# EAGLE schematic ArrayC_v2zp (EAGLE 7.5.0)
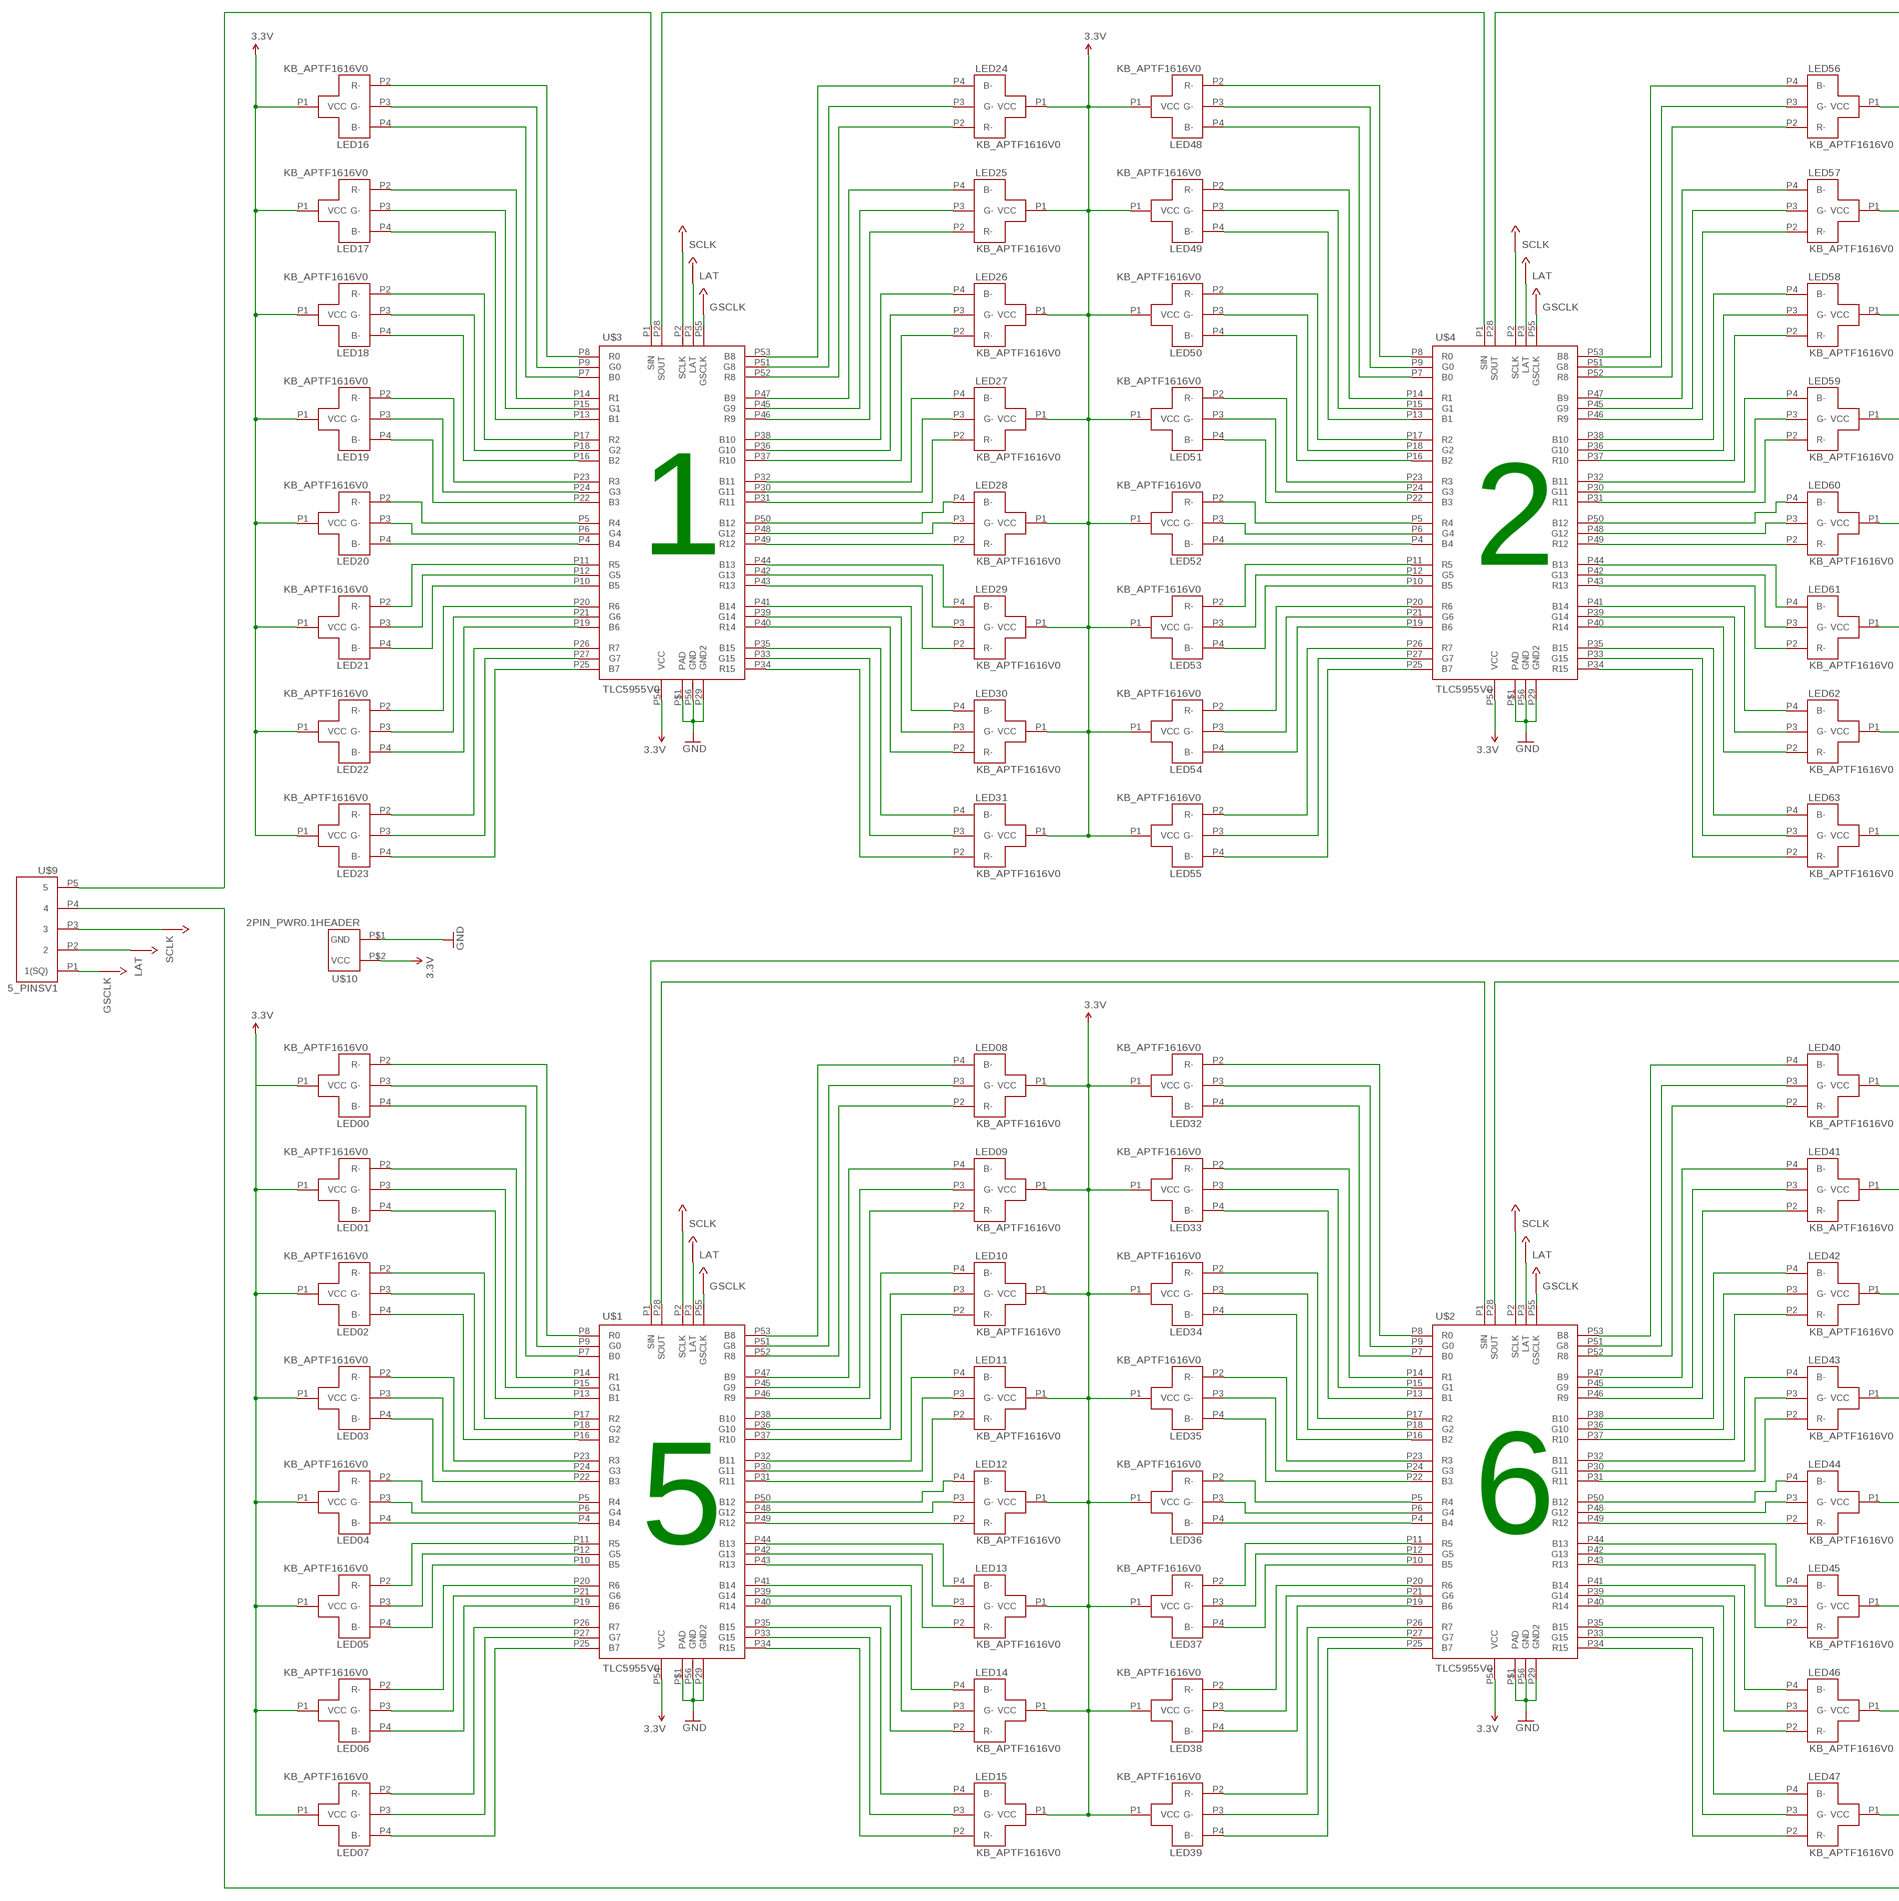
[diagram p0: schematic, sheet 1, part 1 of 2]
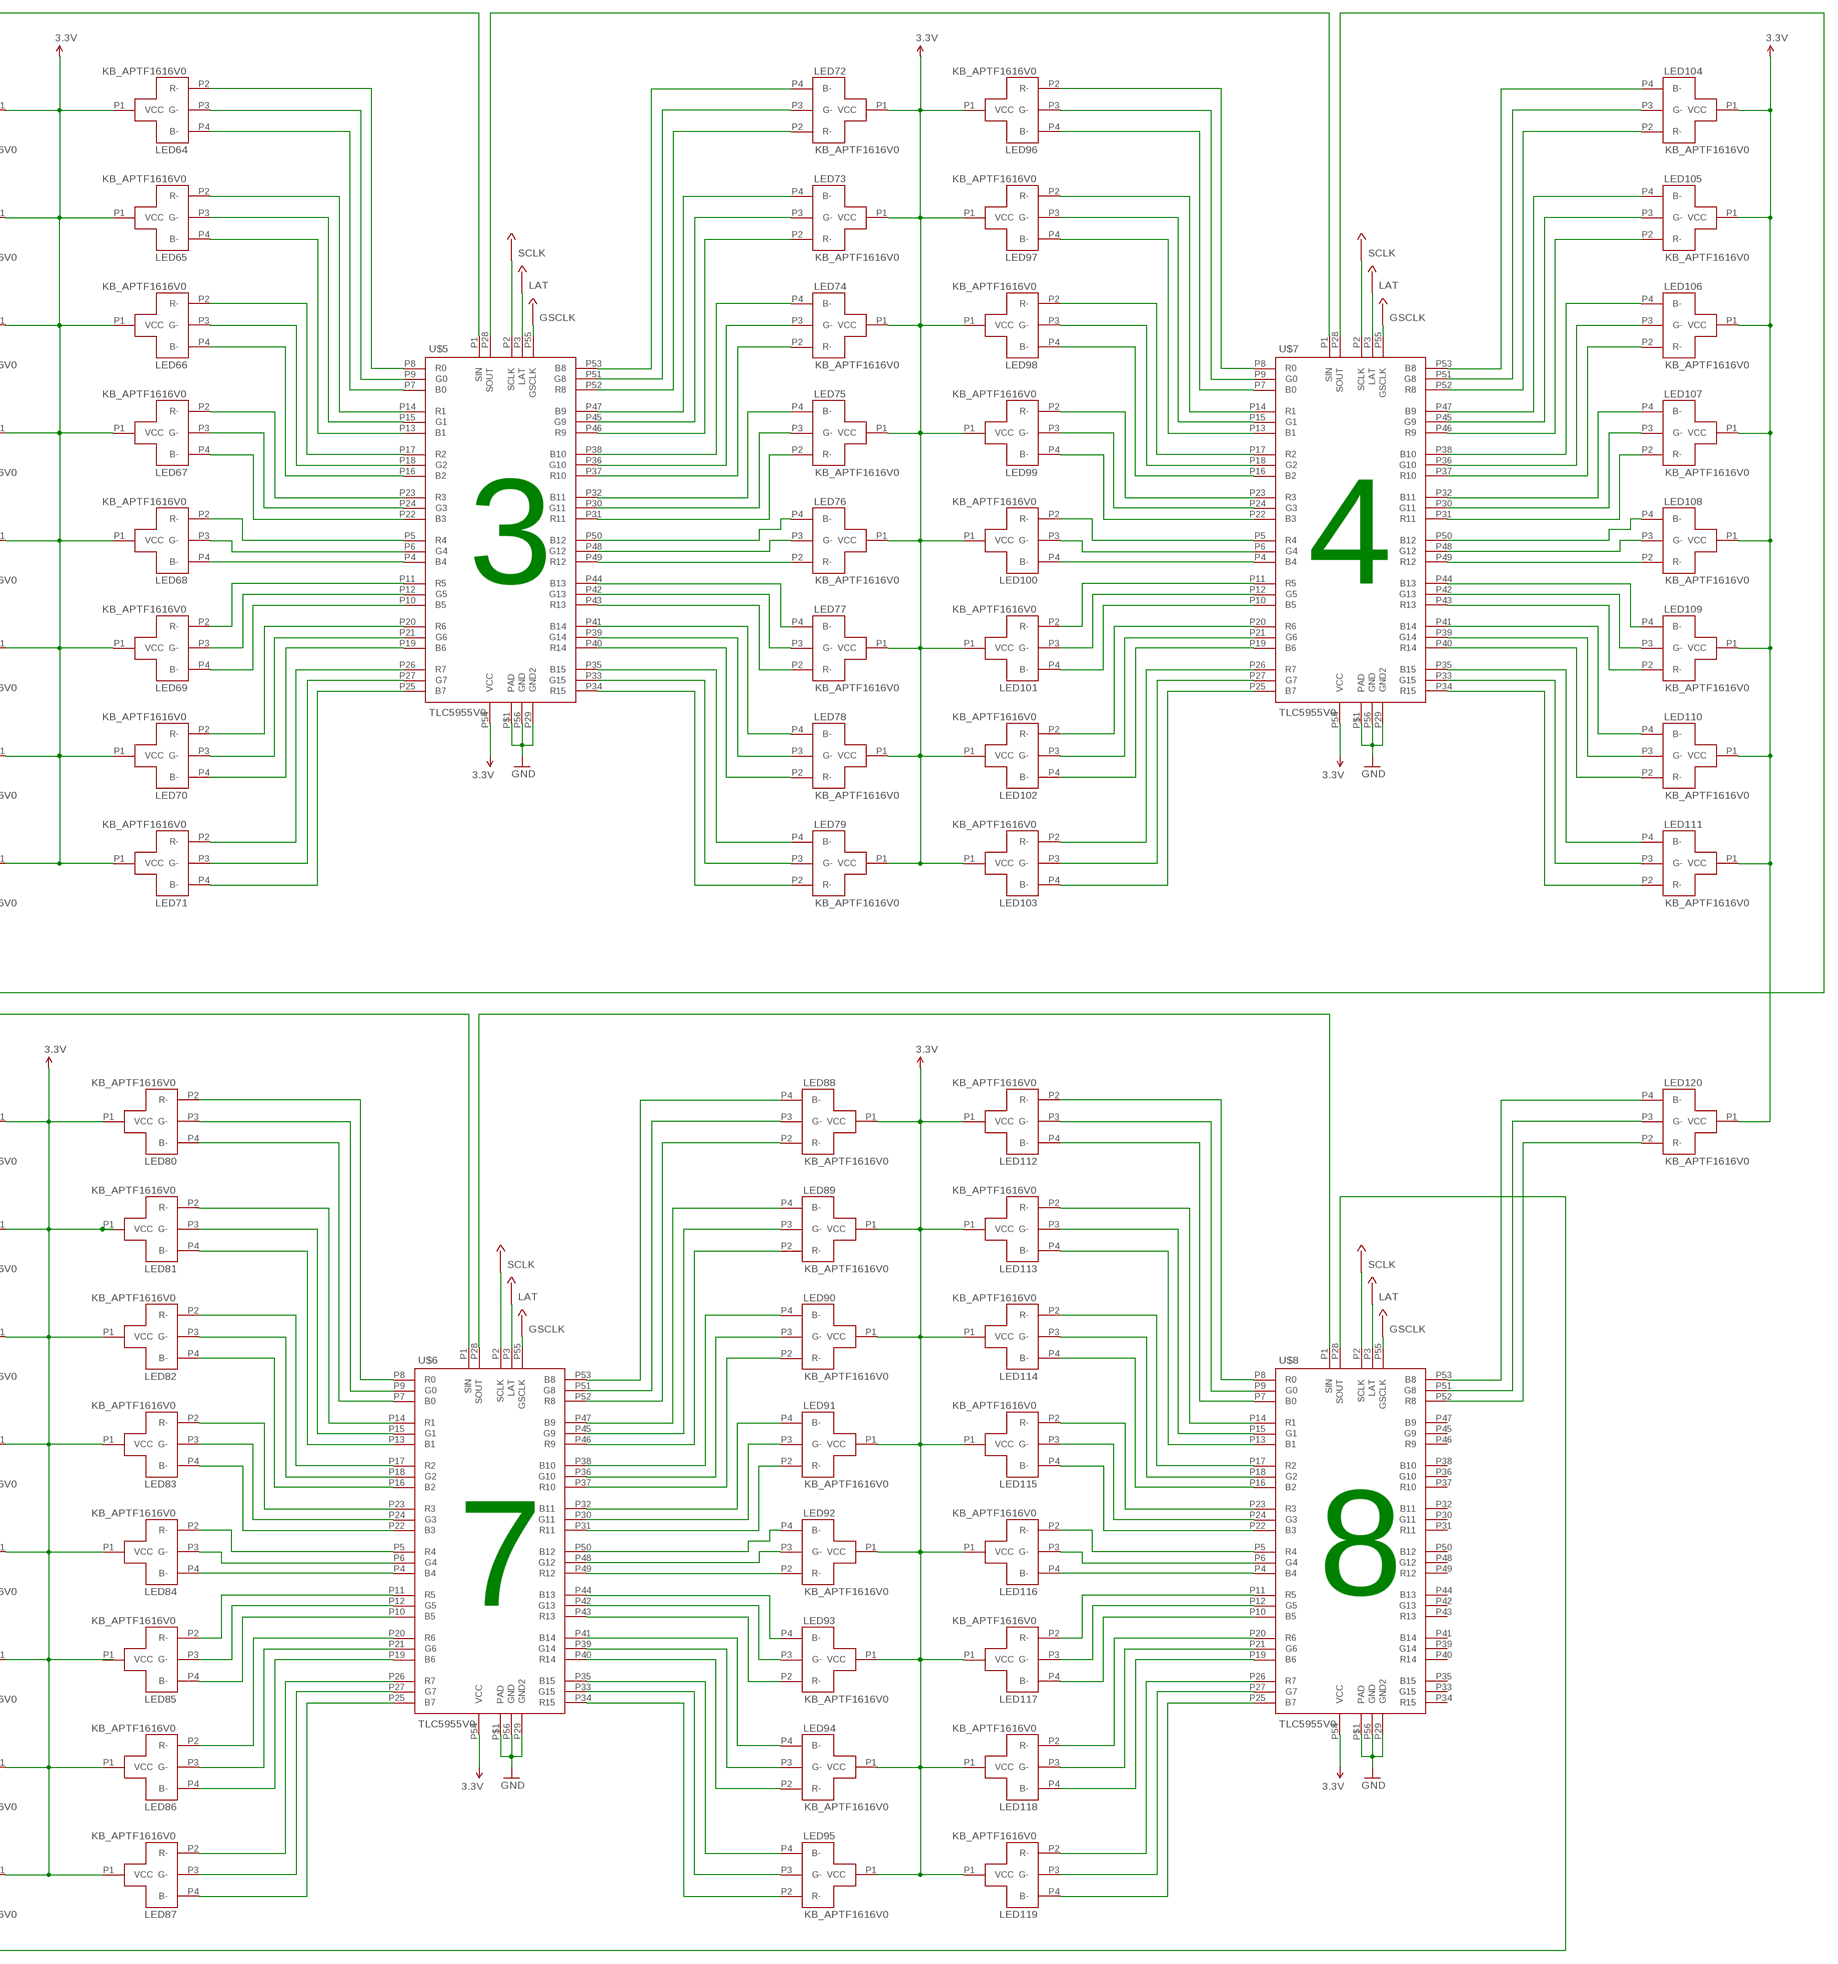
[diagram p1: schematic, sheet 1, part 2 of 2]

## Parts
LED00  KB_APTF1616V0  [KB_RGBLED_APTF1616]
LED01  KB_APTF1616V0  [KB_RGBLED_APTF1616]
LED02  KB_APTF1616V0  [KB_RGBLED_APTF1616]
LED03  KB_APTF1616V0  [KB_RGBLED_APTF1616]
LED04  KB_APTF1616V0  [KB_RGBLED_APTF1616]
LED05  KB_APTF1616V0  [KB_RGBLED_APTF1616]
LED06  KB_APTF1616V0  [KB_RGBLED_APTF1616]
LED07  KB_APTF1616V0  [KB_RGBLED_APTF1616]
LED08  KB_APTF1616V0  [KB_RGBLED_APTF1616]
LED09  KB_APTF1616V0  [KB_RGBLED_APTF1616]
LED10  KB_APTF1616V0  [KB_RGBLED_APTF1616]
LED11  KB_APTF1616V0  [KB_RGBLED_APTF1616]
LED12  KB_APTF1616V0  [KB_RGBLED_APTF1616]
LED13  KB_APTF1616V0  [KB_RGBLED_APTF1616]
LED14  KB_APTF1616V0  [KB_RGBLED_APTF1616]
LED15  KB_APTF1616V0  [KB_RGBLED_APTF1616]
LED16  KB_APTF1616V0  [KB_RGBLED_APTF1616]
LED17  KB_APTF1616V0  [KB_RGBLED_APTF1616]
LED18  KB_APTF1616V0  [KB_RGBLED_APTF1616]
LED19  KB_APTF1616V0  [KB_RGBLED_APTF1616]
LED20  KB_APTF1616V0  [KB_RGBLED_APTF1616]
LED21  KB_APTF1616V0  [KB_RGBLED_APTF1616]
LED22  KB_APTF1616V0  [KB_RGBLED_APTF1616]
LED23  KB_APTF1616V0  [KB_RGBLED_APTF1616]
LED24  KB_APTF1616V0  [KB_RGBLED_APTF1616]
LED25  KB_APTF1616V0  [KB_RGBLED_APTF1616]
LED26  KB_APTF1616V0  [KB_RGBLED_APTF1616]
LED27  KB_APTF1616V0  [KB_RGBLED_APTF1616]
LED28  KB_APTF1616V0  [KB_RGBLED_APTF1616]
LED29  KB_APTF1616V0  [KB_RGBLED_APTF1616]
LED30  KB_APTF1616V0  [KB_RGBLED_APTF1616]
LED31  KB_APTF1616V0  [KB_RGBLED_APTF1616]
LED32  KB_APTF1616V0  [KB_RGBLED_APTF1616]
LED33  KB_APTF1616V0  [KB_RGBLED_APTF1616]
LED34  KB_APTF1616V0  [KB_RGBLED_APTF1616]
LED35  KB_APTF1616V0  [KB_RGBLED_APTF1616]
LED36  KB_APTF1616V0  [KB_RGBLED_APTF1616]
LED37  KB_APTF1616V0  [KB_RGBLED_APTF1616]
LED38  KB_APTF1616V0  [KB_RGBLED_APTF1616]
LED39  KB_APTF1616V0  [KB_RGBLED_APTF1616]
LED40  KB_APTF1616V0  [KB_RGBLED_APTF1616]
LED41  KB_APTF1616V0  [KB_RGBLED_APTF1616]
LED42  KB_APTF1616V0  [KB_RGBLED_APTF1616]
LED43  KB_APTF1616V0  [KB_RGBLED_APTF1616]
LED44  KB_APTF1616V0  [KB_RGBLED_APTF1616]
LED45  KB_APTF1616V0  [KB_RGBLED_APTF1616]
LED46  KB_APTF1616V0  [KB_RGBLED_APTF1616]
LED47  KB_APTF1616V0  [KB_RGBLED_APTF1616]
LED48  KB_APTF1616V0  [KB_RGBLED_APTF1616]
LED49  KB_APTF1616V0  [KB_RGBLED_APTF1616]
LED50  KB_APTF1616V0  [KB_RGBLED_APTF1616]
LED51  KB_APTF1616V0  [KB_RGBLED_APTF1616]
LED52  KB_APTF1616V0  [KB_RGBLED_APTF1616]
LED53  KB_APTF1616V0  [KB_RGBLED_APTF1616]
LED54  KB_APTF1616V0  [KB_RGBLED_APTF1616]
LED55  KB_APTF1616V0  [KB_RGBLED_APTF1616]
LED56  KB_APTF1616V0  [KB_RGBLED_APTF1616]
LED57  KB_APTF1616V0  [KB_RGBLED_APTF1616]
LED58  KB_APTF1616V0  [KB_RGBLED_APTF1616]
LED59  KB_APTF1616V0  [KB_RGBLED_APTF1616]
LED60  KB_APTF1616V0  [KB_RGBLED_APTF1616]
LED61  KB_APTF1616V0  [KB_RGBLED_APTF1616]
LED62  KB_APTF1616V0  [KB_RGBLED_APTF1616]
LED63  KB_APTF1616V0  [KB_RGBLED_APTF1616]
LED64  KB_APTF1616V0  [KB_RGBLED_APTF1616]
LED65  KB_APTF1616V0  [KB_RGBLED_APTF1616]
LED66  KB_APTF1616V0  [KB_RGBLED_APTF1616]
LED67  KB_APTF1616V0  [KB_RGBLED_APTF1616]
LED68  KB_APTF1616V0  [KB_RGBLED_APTF1616]
LED69  KB_APTF1616V0  [KB_RGBLED_APTF1616]
LED70  KB_APTF1616V0  [KB_RGBLED_APTF1616]
LED71  KB_APTF1616V0  [KB_RGBLED_APTF1616]
LED72  KB_APTF1616V0  [KB_RGBLED_APTF1616]
LED73  KB_APTF1616V0  [KB_RGBLED_APTF1616]
LED74  KB_APTF1616V0  [KB_RGBLED_APTF1616]
LED75  KB_APTF1616V0  [KB_RGBLED_APTF1616]
LED76  KB_APTF1616V0  [KB_RGBLED_APTF1616]
LED77  KB_APTF1616V0  [KB_RGBLED_APTF1616]
LED78  KB_APTF1616V0  [KB_RGBLED_APTF1616]
LED79  KB_APTF1616V0  [KB_RGBLED_APTF1616]
LED80  KB_APTF1616V0  [KB_RGBLED_APTF1616]
LED81  KB_APTF1616V0  [KB_RGBLED_APTF1616]
LED82  KB_APTF1616V0  [KB_RGBLED_APTF1616]
LED83  KB_APTF1616V0  [KB_RGBLED_APTF1616]
LED84  KB_APTF1616V0  [KB_RGBLED_APTF1616]
LED85  KB_APTF1616V0  [KB_RGBLED_APTF1616]
LED86  KB_APTF1616V0  [KB_RGBLED_APTF1616]
LED87  KB_APTF1616V0  [KB_RGBLED_APTF1616]
LED88  KB_APTF1616V0  [KB_RGBLED_APTF1616]
LED89  KB_APTF1616V0  [KB_RGBLED_APTF1616]
LED90  KB_APTF1616V0  [KB_RGBLED_APTF1616]
LED91  KB_APTF1616V0  [KB_RGBLED_APTF1616]
LED92  KB_APTF1616V0  [KB_RGBLED_APTF1616]
LED93  KB_APTF1616V0  [KB_RGBLED_APTF1616]
LED94  KB_APTF1616V0  [KB_RGBLED_APTF1616]
LED95  KB_APTF1616V0  [KB_RGBLED_APTF1616]
LED96  KB_APTF1616V0  [KB_RGBLED_APTF1616]
LED97  KB_APTF1616V0  [KB_RGBLED_APTF1616]
LED98  KB_APTF1616V0  [KB_RGBLED_APTF1616]
LED99  KB_APTF1616V0  [KB_RGBLED_APTF1616]
LED100  KB_APTF1616V0  [KB_RGBLED_APTF1616]
LED101  KB_APTF1616V0  [KB_RGBLED_APTF1616]
LED102  KB_APTF1616V0  [KB_RGBLED_APTF1616]
LED103  KB_APTF1616V0  [KB_RGBLED_APTF1616]
LED104  KB_APTF1616V0  [KB_RGBLED_APTF1616]
LED105  KB_APTF1616V0  [KB_RGBLED_APTF1616]
LED106  KB_APTF1616V0  [KB_RGBLED_APTF1616]
LED107  KB_APTF1616V0  [KB_RGBLED_APTF1616]
LED108  KB_APTF1616V0  [KB_RGBLED_APTF1616]
LED109  KB_APTF1616V0  [KB_RGBLED_APTF1616]
LED110  KB_APTF1616V0  [KB_RGBLED_APTF1616]
LED111  KB_APTF1616V0  [KB_RGBLED_APTF1616]
LED112  KB_APTF1616V0  [KB_RGBLED_APTF1616]
LED113  KB_APTF1616V0  [KB_RGBLED_APTF1616]
LED114  KB_APTF1616V0  [KB_RGBLED_APTF1616]
LED115  KB_APTF1616V0  [KB_RGBLED_APTF1616]
LED116  KB_APTF1616V0  [KB_RGBLED_APTF1616]
LED117  KB_APTF1616V0  [KB_RGBLED_APTF1616]
LED118  KB_APTF1616V0  [KB_RGBLED_APTF1616]
LED119  KB_APTF1616V0  [KB_RGBLED_APTF1616]
LED120  KB_APTF1616V0  [KB_RGBLED_APTF1616]
U$1  TLC5955V0  [56-HTSSOP]
U$2  TLC5955V0  [56-HTSSOP]
U$3  TLC5955V0  [56-HTSSOP]
U$4  TLC5955V0  [56-HTSSOP]
U$5  TLC5955V0  [56-HTSSOP]
U$6  TLC5955V0  [56-HTSSOP]
U$7  TLC5955V0  [56-HTSSOP]
U$8  TLC5955V0  [56-HTSSOP]
U$9  5_PINSV1  [5PIN_HOLES]
U$10  2PIN_PWR0.1HEADER  [2PIN_HOLES_PWR]

## Nets
3.3V: LED08.P1(VCC) LED09.P1(VCC) LED10.P1(VCC) LED11.P1(VCC) LED12.P1(VCC) LED13.P1(VCC) LED14.P1(VCC) LED15.P1(VCC) LED16.P1(VCC) LED17.P1(VCC) LED18.P1(VCC) LED19.P1(VCC) LED20.P1(VCC) LED21.P1(VCC) LED22.P1(VCC) LED23.P1(VCC) LED32.P1(VCC) LED33.P1(VCC) LED34.P1(VCC) LED35.P1(VCC) LED36.P1(VCC) LED37.P1(VCC) LED38.P1(VCC) LED39.P1(VCC) LED72.P1(VCC) LED73.P1(VCC) LED74.P1(VCC) LED75.P1(VCC) LED76.P1(VCC) LED77.P1(VCC) LED78.P1(VCC) LED79.P1(VCC) LED88.P1(VCC) LED89.P1(VCC) LED90.P1(VCC) LED91.P1(VCC) LED92.P1(VCC) LED93.P1(VCC) LED94.P1(VCC) LED95.P1(VCC) LED96.P1(VCC) LED97.P1(VCC) LED98.P1(VCC) LED99.P1(VCC) LED100.P1(VCC) LED101.P1(VCC) LED102.P1(VCC) LED103.P1(VCC) LED104.P1(VCC) LED105.P1(VCC) LED106.P1(VCC) LED107.P1(VCC) LED108.P1(VCC) LED109.P1(VCC) LED110.P1(VCC) LED111.P1(VCC) LED112.P1(VCC) LED113.P1(VCC) LED114.P1(VCC) LED115.P1(VCC) LED116.P1(VCC) LED117.P1(VCC) LED118.P1(VCC) LED119.P1(VCC) LED120.P1(VCC) U$1.P54(VCC) U$2.P54(VCC) U$3.P54(VCC) U$4.P54(VCC) U$5.P54(VCC) U$6.P54(VCC) U$7.P54(VCC) U$8.P54(VCC) U$10.P$2(VCC)
GND: U$1.P29(GND2) U$1.P56(GND) U$1.P$1(PAD) U$2.P29(GND2) U$2.P56(GND) U$2.P$1(PAD) U$3.P29(GND2) U$3.P56(GND) U$3.P$1(PAD) U$4.P29(GND2) U$4.P56(GND) U$4.P$1(PAD) U$5.P29(GND2) U$5.P56(GND) U$5.P$1(PAD) U$6.P29(GND2) U$6.P56(GND) U$6.P$1(PAD) U$7.P29(GND2) U$7.P56(GND) U$7.P$1(PAD) U$8.P29(GND2) U$8.P56(GND) U$8.P$1(PAD) U$10.P$1(GND)
GSCLK: U$1.P55(GSCLK) U$2.P55(GSCLK) U$3.P55(GSCLK) U$4.P55(GSCLK) U$5.P55(GSCLK) U$6.P55(GSCLK) U$7.P55(GSCLK) U$8.P55(GSCLK) U$9.P1(1(SQ))
LAT: U$1.P3(LAT) U$2.P3(LAT) U$3.P3(LAT) U$4.P3(LAT) U$5.P3(LAT) U$6.P3(LAT) U$7.P3(LAT) U$8.P3(LAT) U$9.P2
N$1: LED00.P2(R-) U$1.P8(R0)
N$2: LED00.P3(G-) U$1.P9(G0)
N$3: LED00.P4(B-) U$1.P7(B0)
N$4: LED01.P2(R-) U$1.P14(R1)
N$5: LED01.P3(G-) U$1.P15(G1)
N$6: LED01.P4(B-) U$1.P13(B1)
N$7: LED02.P2(R-) U$1.P17(R2)
N$8: LED02.P3(G-) U$1.P18(G2)
N$9: LED02.P4(B-) U$1.P16(B2)
N$10: LED03.P2(R-) U$1.P23(R3)
N$11: LED03.P3(G-) U$1.P24(G3)
N$12: LED03.P4(B-) U$1.P22(B3)
N$13: LED04.P2(R-) U$1.P5(R4)
N$14: LED04.P3(G-) U$1.P6(G4)
N$15: LED04.P4(B-) U$1.P4(B4)
N$16: LED05.P2(R-) U$1.P11(R5)
N$17: LED05.P3(G-) U$1.P12(G5)
N$18: LED05.P4(B-) U$1.P10(B5)
N$19: LED06.P2(R-) U$1.P20(R6)
N$20: LED06.P3(G-) U$1.P21(G6)
N$21: LED06.P4(B-) U$1.P19(B6)
N$22: LED07.P2(R-) U$1.P26(R7)
N$23: LED07.P3(G-) U$1.P27(G7)
N$24: LED07.P4(B-) U$1.P25(B7)
N$25: LED08.P4(B-) U$1.P53(B8)
N$26: LED08.P3(G-) U$1.P51(G8)
N$27: LED08.P2(R-) U$1.P52(R8)
N$28: LED09.P4(B-) U$1.P47(B9)
N$29: LED09.P3(G-) U$1.P45(G9)
N$30: LED09.P2(R-) U$1.P46(R9)
N$31: LED10.P4(B-) U$1.P38(B10)
N$32: LED10.P3(G-) U$1.P36(G10)
N$33: LED10.P2(R-) U$1.P37(R10)
N$34: LED11.P4(B-) U$1.P32(B11)
N$35: LED11.P3(G-) U$1.P30(G11)
N$36: LED12.P4(B-) U$1.P50(B12)
N$37: LED12.P3(G-) U$1.P48(G12)
N$38: LED12.P2(R-) U$1.P49(R12)
N$39: LED13.P4(B-) U$1.P44(B13)
N$40: LED13.P3(G-) U$1.P42(G13)
N$41: LED13.P2(R-) U$1.P43(R13)
N$42: LED14.P4(B-) U$1.P41(B14)
N$43: LED14.P3(G-) U$1.P39(G14)
N$44: LED14.P2(R-) U$1.P40(R14)
N$45: LED15.P4(B-) U$1.P35(B15)
N$46: LED15.P3(G-) U$1.P33(G15)
N$47: LED15.P2(R-) U$1.P34(R15)
N$48: LED32.P2(R-) U$2.P8(R0)
N$49: LED32.P3(G-) U$2.P9(G0)
N$50: LED32.P4(B-) U$2.P7(B0)
N$51: LED33.P2(R-) U$2.P14(R1)
N$52: LED33.P3(G-) U$2.P15(G1)
N$53: LED33.P4(B-) U$2.P13(B1)
N$54: LED34.P2(R-) U$2.P17(R2)
N$55: LED34.P3(G-) U$2.P18(G2)
N$56: LED34.P4(B-) U$2.P16(B2)
N$57: LED35.P2(R-) U$2.P23(R3)
N$58: LED35.P3(G-) U$2.P24(G3)
N$59: LED35.P4(B-) U$2.P22(B3)
N$60: LED36.P2(R-) U$2.P5(R4)
N$61: LED36.P3(G-) U$2.P6(G4)
N$62: LED36.P4(B-) U$2.P4(B4)
N$63: LED37.P2(R-) U$2.P11(R5)
N$64: LED37.P3(G-) U$2.P12(G5)
N$65: LED37.P4(B-) U$2.P10(B5)
N$66: LED38.P2(R-) U$2.P20(R6)
N$67: LED38.P3(G-) U$2.P21(G6)
N$68: LED38.P4(B-) U$2.P19(B6)
N$69: LED39.P2(R-) U$2.P26(R7)
N$70: LED39.P3(G-) U$2.P27(G7)
N$71: LED39.P4(B-) U$2.P25(B7)
N$72: LED40.P4(B-) U$2.P53(B8)
N$73: LED40.P3(G-) U$2.P51(G8)
N$74: LED40.P2(R-) U$2.P52(R8)
N$75: LED41.P4(B-) U$2.P47(B9)
N$76: LED41.P3(G-) U$2.P45(G9)
N$77: LED41.P2(R-) U$2.P46(R9)
N$78: LED42.P4(B-) U$2.P38(B10)
N$79: LED42.P3(G-) U$2.P36(G10)
N$80: LED42.P2(R-) U$2.P37(R10)
N$81: LED43.P4(B-) U$2.P32(B11)
N$82: LED43.P3(G-) U$2.P30(G11)
N$83: LED44.P4(B-) U$2.P50(B12)
N$84: LED44.P3(G-) U$2.P48(G12)
N$85: LED44.P2(R-) U$2.P49(R12)
N$86: LED45.P4(B-) U$2.P44(B13)
N$87: LED45.P3(G-) U$2.P42(G13)
N$88: LED45.P2(R-) U$2.P43(R13)
N$89: LED46.P4(B-) U$2.P41(B14)
N$90: LED46.P3(G-) U$2.P39(G14)
N$91: LED46.P2(R-) U$2.P40(R14)
N$92: LED47.P4(B-) U$2.P35(B15)
N$93: LED47.P3(G-) U$2.P33(G15)
N$94: LED47.P2(R-) U$2.P34(R15)
N$95: LED16.P2(R-) U$3.P8(R0)
N$96: LED16.P3(G-) U$3.P9(G0)
N$97: LED16.P4(B-) U$3.P7(B0)
N$98: LED17.P2(R-) U$3.P14(R1)
N$99: LED17.P3(G-) U$3.P15(G1)
N$100: LED17.P4(B-) U$3.P13(B1)
N$101: LED18.P2(R-) U$3.P17(R2)
N$102: LED18.P3(G-) U$3.P18(G2)
N$103: LED18.P4(B-) U$3.P16(B2)
N$104: LED19.P2(R-) U$3.P23(R3)
N$105: LED19.P3(G-) U$3.P24(G3)
N$106: LED19.P4(B-) U$3.P22(B3)
N$107: LED20.P2(R-) U$3.P5(R4)
N$108: LED20.P3(G-) U$3.P6(G4)
N$109: LED20.P4(B-) U$3.P4(B4)
N$110: LED21.P2(R-) U$3.P11(R5)
N$111: LED21.P3(G-) U$3.P12(G5)
N$112: LED21.P4(B-) U$3.P10(B5)
N$113: LED22.P2(R-) U$3.P20(R6)
N$114: LED22.P3(G-) U$3.P21(G6)
N$115: LED22.P4(B-) U$3.P19(B6)
N$116: LED23.P2(R-) U$3.P26(R7)
N$117: LED23.P3(G-) U$3.P27(G7)
N$118: LED23.P4(B-) U$3.P25(B7)
N$119: LED24.P4(B-) U$3.P53(B8)
N$120: LED24.P3(G-) U$3.P51(G8)
N$121: LED24.P2(R-) U$3.P52(R8)
N$122: LED25.P4(B-) U$3.P47(B9)
N$123: LED25.P3(G-) U$3.P45(G9)
N$124: LED25.P2(R-) U$3.P46(R9)
N$125: LED26.P4(B-) U$3.P38(B10)
N$126: LED26.P3(G-) U$3.P36(G10)
N$127: LED26.P2(R-) U$3.P37(R10)
N$128: LED27.P4(B-) U$3.P32(B11)
N$129: LED27.P3(G-) U$3.P30(G11)
N$130: LED28.P4(B-) U$3.P50(B12)
N$131: LED28.P3(G-) U$3.P48(G12)
N$132: LED28.P2(R-) U$3.P49(R12)
N$133: LED29.P4(B-) U$3.P44(B13)
N$134: LED29.P3(G-) U$3.P42(G13)
N$135: LED29.P2(R-) U$3.P43(R13)
N$136: LED30.P4(B-) U$3.P41(B14)
N$137: LED30.P3(G-) U$3.P39(G14)
N$138: LED30.P2(R-) U$3.P40(R14)
N$139: LED31.P4(B-) U$3.P35(B15)
N$140: LED31.P3(G-) U$3.P33(G15)
N$141: LED31.P2(R-) U$3.P34(R15)
N$142: LED64.P2(R-) U$5.P8(R0)
N$143: LED48.P2(R-) U$4.P8(R0)
N$144: LED48.P3(G-) U$4.P9(G0)
N$145: LED48.P4(B-) U$4.P7(B0)
N$146: LED49.P2(R-) U$4.P14(R1)
N$147: LED49.P3(G-) U$4.P15(G1)
N$148: LED49.P4(B-) U$4.P13(B1)
N$149: LED50.P2(R-) U$4.P17(R2)
N$150: LED50.P3(G-) U$4.P18(G2)
N$151: LED50.P4(B-) U$4.P16(B2)
N$152: LED51.P2(R-) U$4.P23(R3)
N$153: LED51.P3(G-) U$4.P24(G3)
N$154: LED51.P4(B-) U$4.P22(B3)
N$155: LED52.P2(R-) U$4.P5(R4)
N$156: LED52.P3(G-) U$4.P6(G4)
N$157: LED52.P4(B-) U$4.P4(B4)
N$158: LED53.P2(R-) U$4.P11(R5)
N$159: LED53.P3(G-) U$4.P12(G5)
N$160: LED53.P4(B-) U$4.P10(B5)
N$161: LED54.P2(R-) U$4.P20(R6)
N$162: LED54.P3(G-) U$4.P21(G6)
N$163: LED54.P4(B-) U$4.P19(B6)
N$164: LED55.P2(R-) U$4.P26(R7)
N$165: LED55.P3(G-) U$4.P27(G7)
N$166: LED55.P4(B-) U$4.P25(B7)
N$167: LED56.P4(B-) U$4.P53(B8)
N$168: LED56.P3(G-) U$4.P51(G8)
N$169: LED56.P2(R-) U$4.P52(R8)
N$170: LED57.P4(B-) U$4.P47(B9)
N$171: LED57.P3(G-) U$4.P45(G9)
N$172: LED57.P2(R-) U$4.P46(R9)
N$173: LED58.P4(B-) U$4.P38(B10)
N$174: LED58.P3(G-) U$4.P36(G10)
N$175: LED58.P2(R-) U$4.P37(R10)
N$176: LED59.P4(B-) U$4.P32(B11)
N$177: LED59.P3(G-) U$4.P30(G11)
N$178: LED60.P4(B-) U$4.P50(B12)
N$179: LED60.P3(G-) U$4.P48(G12)
N$180: LED60.P2(R-) U$4.P49(R12)
N$181: LED61.P4(B-) U$4.P44(B13)
N$182: LED61.P3(G-) U$4.P42(G13)
N$183: LED61.P2(R-) U$4.P43(R13)
N$184: LED62.P4(B-) U$4.P41(B14)
N$185: LED62.P3(G-) U$4.P39(G14)
N$186: LED62.P2(R-) U$4.P40(R14)
N$187: LED63.P4(B-) U$4.P35(B15)
N$188: LED63.P3(G-) U$4.P33(G15)
N$189: LED63.P2(R-) U$4.P34(R15)
N$190: LED64.P3(G-) U$5.P9(G0)
N$191: LED64.P4(B-) U$5.P7(B0)
N$192: LED65.P2(R-) U$5.P14(R1)
N$193: LED65.P3(G-) U$5.P15(G1)
N$194: LED65.P4(B-) U$5.P13(B1)
N$195: LED66.P2(R-) U$5.P17(R2)
N$196: LED66.P3(G-) U$5.P18(G2)
N$197: LED66.P4(B-) U$5.P16(B2)
N$198: LED67.P2(R-) U$5.P23(R3)
N$199: LED67.P3(G-) U$5.P24(G3)
N$200: LED67.P4(B-) U$5.P22(B3)
N$201: LED68.P2(R-) U$5.P5(R4)
N$202: LED68.P3(G-) U$5.P6(G4)
N$203: LED68.P4(B-) U$5.P4(B4)
N$204: LED69.P2(R-) U$5.P11(R5)
N$205: LED69.P3(G-) U$5.P12(G5)
N$206: LED69.P4(B-) U$5.P10(B5)
N$207: LED70.P2(R-) U$5.P20(R6)
N$208: LED70.P3(G-) U$5.P21(G6)
N$209: LED70.P4(B-) U$5.P19(B6)
N$210: LED71.P2(R-) U$5.P26(R7)
N$211: LED71.P3(G-) U$5.P27(G7)
N$212: LED71.P4(B-) U$5.P25(B7)
N$213: LED72.P4(B-) U$5.P53(B8)
N$214: LED72.P3(G-) U$5.P51(G8)
N$215: LED72.P2(R-) U$5.P52(R8)
N$216: LED73.P4(B-) U$5.P47(B9)
N$217: LED73.P3(G-) U$5.P45(G9)
N$218: LED73.P2(R-) U$5.P46(R9)
N$219: LED74.P4(B-) U$5.P38(B10)
N$220: LED74.P3(G-) U$5.P36(G10)
N$221: LED74.P2(R-) U$5.P37(R10)
N$222: LED75.P4(B-) U$5.P32(B11)
N$223: LED75.P3(G-) U$5.P30(G11)
N$224: LED76.P4(B-) U$5.P50(B12)
N$225: LED76.P3(G-) U$5.P48(G12)
N$226: LED76.P2(R-) U$5.P49(R12)
N$227: LED77.P4(B-) U$5.P44(B13)
N$228: LED77.P3(G-) U$5.P42(G13)
N$229: LED77.P2(R-) U$5.P43(R13)
N$230: LED78.P4(B-) U$5.P41(B14)
N$231: LED78.P3(G-) U$5.P39(G14)
N$232: LED78.P2(R-) U$5.P40(R14)
N$233: LED79.P4(B-) U$5.P35(B15)
N$234: LED79.P3(G-) U$5.P33(G15)
N$235: LED79.P2(R-) U$5.P34(R15)
N$236: LED80.P2(R-) U$6.P8(R0)
N$237: LED80.P3(G-) U$6.P9(G0)
N$238: LED80.P4(B-) U$6.P7(B0)
N$239: LED81.P2(R-) U$6.P14(R1)
N$240: LED81.P3(G-) U$6.P15(G1)
N$241: LED81.P4(B-) U$6.P13(B1)
N$242: LED82.P2(R-) U$6.P17(R2)
N$243: LED82.P3(G-) U$6.P18(G2)
N$244: LED82.P4(B-) U$6.P16(B2)
N$245: LED83.P2(R-) U$6.P23(R3)
N$246: LED83.P3(G-) U$6.P24(G3)
N$247: LED83.P4(B-) U$6.P22(B3)
N$248: LED84.P2(R-) U$6.P5(R4)
N$249: LED84.P3(G-) U$6.P6(G4)
N$250: LED84.P4(B-) U$6.P4(B4)
N$251: LED85.P2(R-) U$6.P11(R5)
N$252: LED85.P3(G-) U$6.P12(G5)
N$253: LED85.P4(B-) U$6.P10(B5)
N$254: LED86.P2(R-) U$6.P20(R6)
N$255: LED86.P3(G-) U$6.P21(G6)
N$256: LED86.P4(B-) U$6.P19(B6)
N$257: LED87.P2(R-) U$6.P26(R7)
N$258: LED87.P3(G-) U$6.P27(G7)
N$259: LED87.P4(B-) U$6.P25(B7)
N$260: LED88.P4(B-) U$6.P53(B8)
N$261: LED88.P3(G-) U$6.P51(G8)
N$262: LED88.P2(R-) U$6.P52(R8)
N$263: LED89.P4(B-) U$6.P47(B9)
N$264: LED89.P3(G-) U$6.P45(G9)
N$265: LED89.P2(R-) U$6.P46(R9)
N$266: LED90.P4(B-) U$6.P38(B10)
N$267: LED90.P3(G-) U$6.P36(G10)
N$268: LED90.P2(R-) U$6.P37(R10)
N$269: LED91.P4(B-) U$6.P32(B11)
N$270: LED91.P3(G-) U$6.P30(G11)
N$271: LED92.P4(B-) U$6.P50(B12)
N$272: LED92.P3(G-) U$6.P48(G12)
N$273: LED92.P2(R-) U$6.P49(R12)
N$274: LED93.P4(B-) U$6.P44(B13)
N$275: LED93.P3(G-) U$6.P42(G13)
N$276: LED93.P2(R-) U$6.P43(R13)
N$277: LED94.P4(B-) U$6.P41(B14)
N$278: LED94.P3(G-) U$6.P39(G14)
N$279: LED94.P2(R-) U$6.P40(R14)
N$280: LED95.P4(B-) U$6.P35(B15)
N$281: LED95.P3(G-) U$6.P33(G15)
N$282: LED95.P2(R-) U$6.P34(R15)
N$283: LED96.P2(R-) U$7.P8(R0)
N$284: LED96.P3(G-) U$7.P9(G0)
N$285: LED96.P4(B-) U$7.P7(B0)
N$286: LED97.P2(R-) U$7.P14(R1)
N$287: LED97.P3(G-) U$7.P15(G1)
N$288: LED97.P4(B-) U$7.P13(B1)
N$289: LED98.P2(R-) U$7.P17(R2)
N$290: LED98.P3(G-) U$7.P18(G2)
N$291: LED98.P4(B-) U$7.P16(B2)
N$292: LED99.P2(R-) U$7.P23(R3)
N$293: LED99.P3(G-) U$7.P24(G3)
N$294: LED99.P4(B-) U$7.P22(B3)
N$295: LED100.P2(R-) U$7.P5(R4)
N$296: LED100.P3(G-) U$7.P6(G4)
N$297: LED100.P4(B-) U$7.P4(B4)
N$298: LED101.P2(R-) U$7.P11(R5)
N$299: LED101.P3(G-) U$7.P12(G5)
N$300: LED101.P4(B-) U$7.P10(B5)
N$301: LED102.P2(R-) U$7.P20(R6)
N$302: LED102.P3(G-) U$7.P21(G6)
N$303: LED102.P4(B-) U$7.P19(B6)
N$304: LED103.P2(R-) U$7.P26(R7)
N$305: LED103.P3(G-) U$7.P27(G7)
N$306: LED103.P4(B-) U$7.P25(B7)
N$307: LED104.P4(B-) U$7.P53(B8)
N$308: LED104.P3(G-) U$7.P51(G8)
N$309: LED104.P2(R-) U$7.P52(R8)
N$310: LED105.P4(B-) U$7.P47(B9)
N$311: LED105.P3(G-) U$7.P45(G9)
N$312: LED105.P2(R-) U$7.P46(R9)
N$313: LED106.P4(B-) U$7.P38(B10)
N$314: LED106.P3(G-) U$7.P36(G10)
N$315: LED106.P2(R-) U$7.P37(R10)
N$316: LED107.P4(B-) U$7.P32(B11)
N$317: LED107.P3(G-) U$7.P30(G11)
N$318: LED108.P4(B-) U$7.P50(B12)
N$319: LED108.P3(G-) U$7.P48(G12)
N$320: LED108.P2(R-) U$7.P49(R12)
N$321: LED109.P4(B-) U$7.P44(B13)
N$322: LED109.P3(G-) U$7.P42(G13)
N$323: LED109.P2(R-) U$7.P43(R13)
N$324: LED110.P4(B-) U$7.P41(B14)
N$325: LED110.P3(G-) U$7.P39(G14)
N$326: LED110.P2(R-) U$7.P40(R14)
N$327: LED111.P4(B-) U$7.P35(B15)
N$328: LED111.P3(G-) U$7.P33(G15)
N$329: LED111.P2(R-) U$7.P34(R15)
N$330: LED112.P2(R-) U$8.P8(R0)
N$331: LED112.P3(G-) U$8.P9(G0)
N$332: LED112.P4(B-) U$8.P7(B0)
N$333: LED113.P2(R-) U$8.P14(R1)
N$334: LED113.P3(G-) U$8.P15(G1)
N$335: LED113.P4(B-) U$8.P13(B1)
N$336: LED114.P2(R-) U$8.P17(R2)
N$337: LED114.P3(G-) U$8.P18(G2)
N$338: LED114.P4(B-) U$8.P16(B2)
N$339: LED115.P2(R-) U$8.P23(R3)
N$340: LED115.P3(G-) U$8.P24(G3)
N$341: LED115.P4(B-) U$8.P22(B3)
N$342: LED116.P2(R-) U$8.P5(R4)
N$343: LED116.P3(G-) U$8.P6(G4)
N$344: LED116.P4(B-) U$8.P4(B4)
N$345: LED117.P2(R-) U$8.P11(R5)
N$346: LED117.P3(G-) U$8.P12(G5)
N$347: LED117.P4(B-) U$8.P10(B5)
N$348: LED118.P2(R-) U$8.P20(R6)
N$349: LED118.P3(G-) U$8.P21(G6)
N$350: LED118.P4(B-) U$8.P19(B6)
N$351: LED119.P2(R-) U$8.P26(R7)
N$352: LED119.P3(G-) U$8.P27(G7)
N$353: LED119.P4(B-) U$8.P25(B7)
N$354: LED120.P4(B-) U$8.P53(B8)
N$355: LED120.P3(G-) U$8.P51(G8)
N$356: LED120.P2(R-) U$8.P52(R8)
N$357: U$1.P28(SOUT) U$2.P1(SIN)
N$358: U$2.P28(SOUT) U$6.P1(SIN)
N$359: U$6.P28(SOUT) U$8.P1(SIN)
N$360: U$1.P1(SIN) U$7.P28(SOUT)
N$361: U$5.P28(SOUT) U$7.P1(SIN)
N$362: U$4.P28(SOUT) U$5.P1(SIN)
N$363: U$3.P28(SOUT) U$4.P1(SIN)
N$364: LED107.P2(R-) U$7.P31(R11)
N$365: U$3.P1(SIN) U$9.P5
N$366: U$8.P28(SOUT) U$9.P4
N$367: LED40.P1(VCC) LED41.P1(VCC) LED42.P1(VCC) LED43.P1(VCC) LED44.P1(VCC) LED45.P1(VCC) LED46.P1(VCC) LED47.P1(VCC) LED80.P1(VCC) LED81.P1(VCC) LED82.P1(VCC) LED83.P1(VCC) LED84.P1(VCC) LED86.P1(VCC) LED87.P1(VCC)
N$368: LED43.P2(R-) U$2.P31(R11)
N$369: LED00.P1(VCC) LED01.P1(VCC) LED02.P1(VCC) LED03.P1(VCC) LED04.P1(VCC) LED05.P1(VCC) LED06.P1(VCC) LED07.P1(VCC)
N$370: LED11.P2(R-) U$1.P31(R11)
N$371: LED91.P2(R-) U$6.P31(R11)
N$372: LED75.P2(R-) U$5.P31(R11)
N$373: LED59.P2(R-) U$4.P31(R11)
N$374: LED24.P1(VCC) LED25.P1(VCC) LED26.P1(VCC) LED27.P1(VCC) LED28.P1(VCC) LED29.P1(VCC) LED30.P1(VCC) LED31.P1(VCC) LED48.P1(VCC) LED49.P1(VCC) LED50.P1(VCC) LED51.P1(VCC) LED52.P1(VCC) LED53.P1(VCC) LED54.P1(VCC) LED55.P1(VCC)
N$375: LED27.P2(R-) U$3.P31(R11)
N$384: LED56.P1(VCC) LED57.P1(VCC) LED58.P1(VCC) LED59.P1(VCC) LED60.P1(VCC) LED61.P1(VCC) LED62.P1(VCC) LED63.P1(VCC) LED64.P1(VCC) LED65.P1(VCC) LED66.P1(VCC) LED67.P1(VCC) LED68.P1(VCC) LED69.P1(VCC) LED70.P1(VCC) LED71.P1(VCC)
SCLK: U$1.P2(SCLK) U$2.P2(SCLK) U$3.P2(SCLK) U$4.P2(SCLK) U$5.P2(SCLK) U$6.P2(SCLK) U$7.P2(SCLK) U$8.P2(SCLK) U$9.P3
Unconnected: LED85.P1(VCC) U$8.P30(G11) U$8.P31(R11) U$8.P32(B11) U$8.P33(G15) U$8.P34(R15) U$8.P35(B15) U$8.P36(G10) U$8.P37(R10) U$8.P38(B10) U$8.P39(G14) U$8.P40(R14) U$8.P41(B14) U$8.P42(G13) U$8.P43(R13) U$8.P44(B13) U$8.P45(G9) U$8.P46(R9) U$8.P47(B9) U$8.P48(G12) U$8.P49(R12) U$8.P50(B12)

## Notes on the sheet
- 1 | 2 | 3 | 4
- 5 | 6 | 7 | 8

## Library data of the parts
LED00 LED01-LED09 LED10-LED120 = ZacksLib:KB_APTF1616
U$1-U$8 = WallerLabLib:TLC5955
U$9 = WallerLabLib:5_PINS
U$10 = WallerLabLib:2PIN_PWR